# EAGLE design untitled (EAGLE 9.6.2)
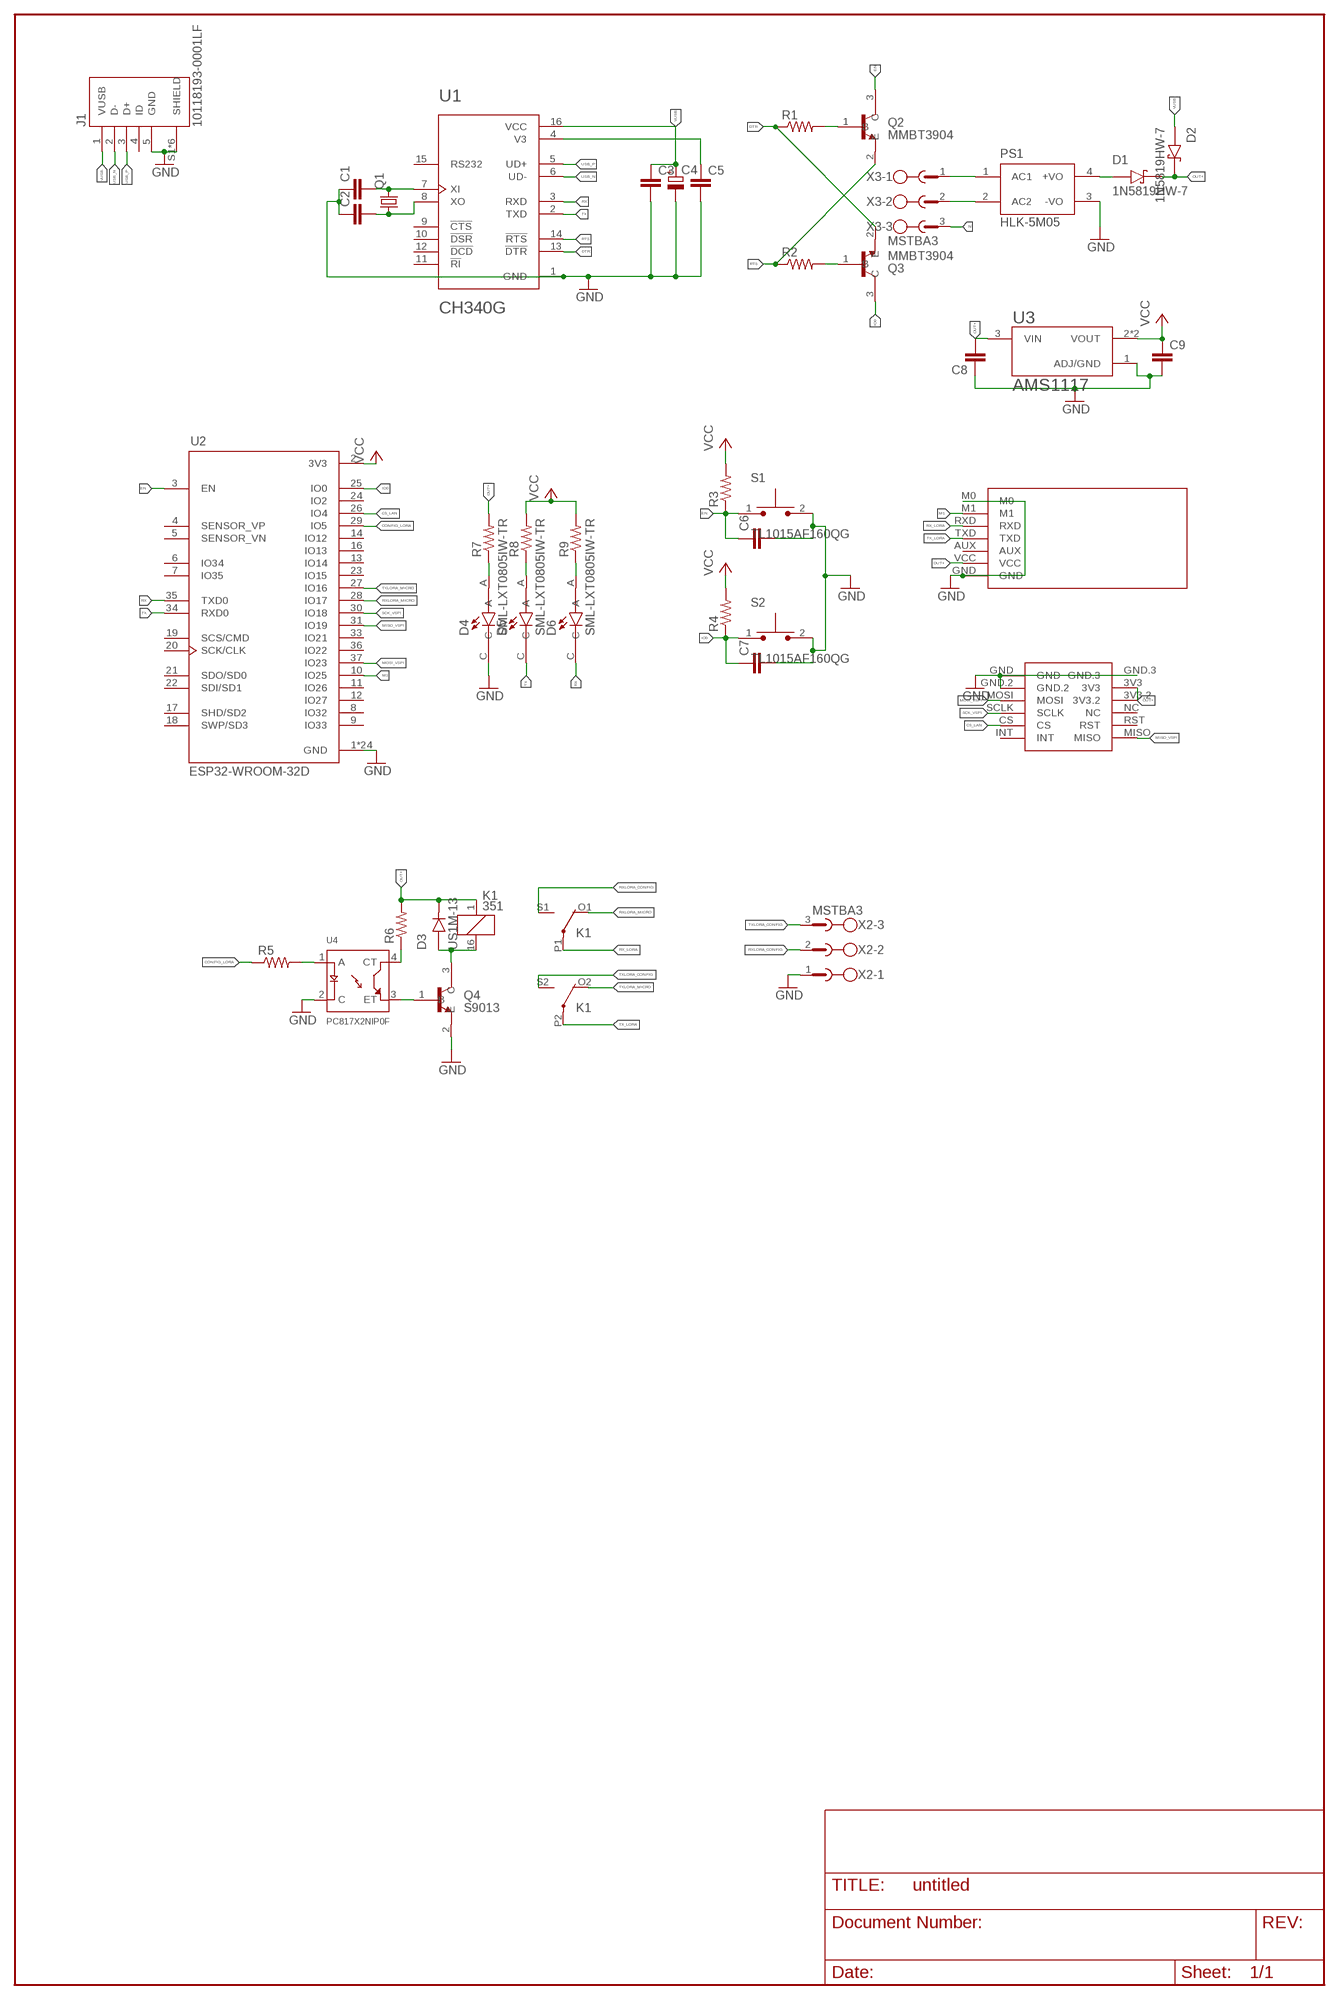
[diagram p0: schematic, sheet 1]

## Parts
C1  C-EUC0805K  [C0805K]
C2  C-EUC0805K  [C0805K]
C3  C-EUC0805K  [C0805K]
C4  CPOL-EU153CLV-0505  [153CLV-0505]
C5  C-EUC0805K  [C0805K]
C6  C-EUC0805K  [C0805K]
C7  C-EUC0805K  [C0805K]
C8  C-EUC0805K  [C0805K]
C9  C-EUC0805K  [C0805K]
D1  1N5819HW-7  [SOD3715X145N]
D2  1N5819HW-7  [SOD3715X145N]
D3  US1M-13  [DIOM5226X240N]
D4  SML-LXT0805IW-TR  [LEDC2012X120N]
D5  SML-LXT0805IW-TR  [LEDC2012X120N]
D6  SML-LXT0805IW-TR  [LEDC2012X120N]
EBYTEE220-900T22D1  EBYTEE220-900T22D  [EBYTEE220-900T22D]
J1  10118193-0001LF  [FCI_10118193-0001LF]
K1  351  [351]
PS1  HLK-5M05  [CONV_HLK-5M05]
Q1  CRYSTALSM49  [SM49]
Q2  MMBT3904  [SOT95P240X120-3N]
Q3  MMBT3904  [SOT95P240X120-3N]
Q4  S9013  [SOT95P240X120-3N]
R1  R-US_M0805  [M0805]
R2  R-US_M0805  [M0805]
R3  R-US_M0805  [M0805]
R4  R-US_M0805  [M0805]
R5  R-US_M0805  [M0805]
R6  R-US_M0805  [M0805]
R7  R-US_M0805  [M0805]
R8  R-US_M0805  [M0805]
R9  R-US_M0805  [M0805]
S1  TL1015AF160QG  [SW_TL1015AF160QG]
S2  TL1015AF160QG  [SW_TL1015AF160QG]
U1  CH340G  [SOIC127P600X180-16N]
U2  ESP32-WROOM-32D  [MODULE_ESP32-WROOM-32D]
U3  AMS1117  [SOT229P700X180-4N]
U4  PC817X2NIP0F  [SOT254P975X400-4N]
U$1  MINI_W5500  [MINI_W5500]
X2  MSTBA3  [MSTBA3]
X3  MSTBA3  [MSTBA3]

## Nets
CONFIG_LORA: R5.1 U2.29(IO5)
CS_LAN: U2.26(IO4) U$1.CS
DTR: Q3.2(E) R1.1 U1.13(!DTR)
EN: C6.1 Q2.3(C) R3.1 S1.1 U2.3(EN)
GND: C1.1 C2.1 C3.2 C4.- C5.2 C6.2 C7.2 C8.1 C9.2 D4.C EBYTEE220-900T22D1.GND EBYTEE220-900T22D1.M0 J1.5(GND) J1.S1(SHIELD) J1.S2(SHIELD) J1.S3(SHIELD) J1.S4(SHIELD) J1.S5(SHIELD) J1.S6(SHIELD) PS1.3(-VO) Q4.2(E) S1.2 S2.2 U1.1(GND) U2.1(GND) U2.15(GND) U2.38(GND) U2.39_1(GND) U2.39_2(GND) U2.39_3(GND) U2.39_4(GND) U2.39_5(GND) U2.39_6(GND) U2.39_7(GND) U2.39_8(GND) U2.39_9(GND) U2.39_10(GND) U2.39_11(GND) U2.39_12(GND) U2.39_13(GND) U2.39_14(GND) U2.39_15(GND) U2.39_16(GND) U2.39_17(GND) U2.39_18(GND) U2.39_19(GND) U2.39_20(GND) U2.39_21(GND) U3.1(ADJ/GND) U4.2(C) U$1.GND U$1.GND.2 U$1.GND.3 X2.1
IO0: C7.1 Q3.3(C) R4.1 S2.1 U2.25(IO0)
M1: EBYTEE220-900T22D1.M1 U2.10(IO25)
MISO_VSPI: U2.31(IO19) U$1.MISO
MOSI_VSPI: U2.37(IO23) U$1.MOSI
N: X3.3
N$1: D1.A PS1.4(+VO)
N$2: C5.1 U1.4(V3)
N$3: Q2.1(B) R1.2
N$4: Q3.1(B) R2.2
N$5: R5.2 U4.1(A)
N$6: D4.A R7.1
N$7: R6.1 U4.4(CT)
N$8: D3.A K1.16 Q4.3(C)
N$9: C1.2 Q1.2 U1.7(XI)
N$10: C2.2 Q1.1 U1.8(XO)
N$11: D5.A R8.1
N$12: Q4.1(B) U4.3(ET)
N$13: PS1.1(AC1) X3.1
N$14: PS1.2(AC2) X3.2
N$15: D6.A R9.1
OUT+: C8.2 D1.C(K) D2.C(K) D3.C(K) EBYTEE220-900T22D1.VCC K1.1 R6.2 R7.2 U3.3(VIN) U$1.3V3 U$1.3V3.2
RTS: Q2.2(E) R2.1 U1.14(!RTS)
RX: D6.C U1.3(RXD) U2.35(TXD0)
RX_LORA: EBYTEE220-900T22D1.RXD K1.P1(2:P)
RXLORA_CONFIG: K1.S1(2:S) X2.2
RXLORA_MICRO: K1.O1(2:O) U2.28(IO17)
SCK_VSPI: U2.30(IO18) U$1.SCLK
TX: D5.C U1.2(TXD) U2.34(RXD0)
TX_LORA: EBYTEE220-900T22D1.TXD K1.P2(3:P)
TXLORA_CONFIG: K1.S2(3:S) X2.3
TXLORA_MICRO: K1.O2(3:O) U2.27(IO16)
USB_N: J1.2(D-) U1.6(UD-)
USB_P: J1.3(D+) U1.5(UD+)
VCC: C9.1 R3.2 R4.2 R8.2 R9.2 U2.2(3V3) U3.2(VOUT) U3.4(VOUT)
VUSB: C3.1 C4.+ D2.A J1.1(VUSB) U1.16(VCC)
Unconnected: EBYTEE220-900T22D1.AUX J1.4(ID) U1.9(!CTS) U1.10(!DSR) U1.11(!RI) U1.12(!DCD) U1.15(RS232) U2.4(SENSOR_VP) U2.5(SENSOR_VN) U2.6(IO34) U2.7(IO35) U2.8(IO32) U2.9(IO33) U2.11(IO26) U2.12(IO27) U2.13(IO14) U2.14(IO12) U2.16(IO13) U2.17(SHD/SD2) U2.18(SWP/SD3) U2.19(SCS/CMD) U2.20(SCK/CLK) U2.21(SDO/SD0) U2.22(SDI/SD1) U2.23(IO15) U2.24(IO2) U2.33(IO21) U2.36(IO22) U$1.INT U$1.NC U$1.RST

## Library data of the parts
C1-C3 C5-C9 = rcl:C-EU: CAPACITOR, European symbol; SPICEPREFIX: C
C4 = rcl:CPOL-EU: POLARIZED CAPACITOR, European symbol; SPICEPREFIX: C
D1 D2 = 1N5819HW-7:1N5819HW-7: 1N5819HW Series 40 V 1 A Surface Mount Schottky Barrier Rectifier - SOD-123 Check availability <https://pricing.snapeda.com/parts/1N5819HW-7/Diodes%20Inc./view-part?ref=eda>; AVAILABILITY: In Stock; DESCRIPTION: Diode Schottky 40 V 1A Surface Mount SOD-123; MF: Diodes Inc.; MP: 1N5819HW-7; PACKAGE: SOD-123 Fairchild Semiconductor; PRICE: None; PURCHASE-URL: https://pricing.snapeda.com/search/part/1N5819HW-7/?ref=eda
D3 = US1M-13:US1M-13: Diode, Fast Recovery, 1a, 1kv, Do-214ac-2, Full Reel Check availability <https://pricing.snapeda.com/parts/US1M-13/Diodes%20Incorporated/view-part?ref=eda>; AVAILABILITY: In Stock; DESCRIPTION: Diode Standard 1000 V 1A Surface Mount SMA; MF: Diodes Incorporated; MP: US1M-13; PACKAGE: DO-214AC-214 Diodes Incorporated; PRICE: None; PURCHASE-URL: https://pricing.snapeda.com/search/part/US1M-13/?ref=eda
D4-D6 = SML-LXT0805IW-TR:SML-LXT0805IW-TR: LED; Luminous Intensity:11µcd; Viewing Angle:140°; Forward Current:30mA; Forward Voltage:2V; Color:Red; LED Color:Red; Leaded Process Compatible:Yes; Lens Color:White; Mounting Type:Surface Mount ;RoHS Compliant: Yes Check availability <https://pricing.snapeda.com/parts/SML-LXT0805IW-TR/Lumex%20Opto/Components/view-part?ref=eda>; AVAILABILITY: In Stock; DESCRIPTION: Red - LED Indication - Discrete 2V 0805 (2012 Metric); MF: Lumex Opto/Components; MP: SML-LXT0805IW-TR; PACKAGE: 0805 Lumex; PRICE: None; PURCHASE-URL: https://pricing.snapeda.com/search/part/SML-LXT0805IW-TR/?ref=eda
EBYTEE220-900T22D1 = EByte E220-900T22D:EBYTEE220-900T22D
J1 = 10118193-0001LF:10118193-0001LF: Micro USB B Type Receptacle Check availability <https://pricing.snapeda.com/parts/10118193-0001LF/FCI/view-part?ref=eda>; AVAILABILITY: In Stock; DESCRIPTION: USB - micro B USB 2.0 Receptacle Connector 5 Position Surface Mount, Right Angle; Through Hole; MF: FCI; MP: 10118193-0001LF; PACKAGE: None; PRICE: None; PURCHASE-URL: https://pricing.snapeda.com/search/part/10118193-0001LF/?ref=eda
K1 = relay:351: RELAY 2 x switch, Omron; OC_FARNELL: unknown; OC_NEWARK: unknown
PS1 = HLK-5M05:HLK-5M05: AC DC 220V to 5V 5W 5Watt Isolated Switching Step-Down Power Supply Module Converter Check availability <https://pricing.snapeda.com/parts/HLK-5M05/Hi-link/view-part?ref=eda>; AVAILABILITY: Not in stock; MF: Hi-link; MP: HLK-5M05; PACKAGE: Package; PRICE: None
Q1 = crystal:CRYSTAL: CRYSTAL; OC_FARNELL: unknown; OC_NEWARK: unknown
Q2 Q3 = MMBT3904:MMBT3904: MMBT3904 Series 40 V CE Breakdown 0.2 A NPN General Purpose Amplifier - SOT-23 Check availability <https://pricing.snapeda.com/parts/MMBT3904/ON%20Semiconductor/view-part?ref=eda>; AVAILABILITY: In Stock; DESCRIPTION: Bipolar (BJT) Transistor NPN 40 V 200 mA 300MHz 300 mW Surface Mount SOT-23-3 (TO-236); MF: ON Semiconductor; MP: MMBT3904; PACKAGE: SOT-23-3 Motorola; PRICE: None
Q4 = S9013:S9013: SMD Transistors NPN 25V-500mA Check availability <https://pricing.snapeda.com/parts/S9013/JCET/view-part?ref=eda>; AVAILABILITY: In Stock; DESCRIPTION: Bipolar (BJT) Transistor NPN 20V 500mA 625mW Through Hole TO-92-3; MF: JCET; MP: S9013; PACKAGE: SOT-23-3 JCET; PRICE: None; PURCHASE-URL: https://pricing.snapeda.com/search/part/S9013/?ref=eda
R1-R9 = rcl:R-US_: RESISTOR, American symbol; SPICEPREFIX: R
S1 S2 = TL1015AF160QG:TL1015AF160QG: Tactile Switch SPST-NO Top Actuated Surface Mount Check availability <https://pricing.snapeda.com/parts/TL1015AF160QG/E-Switch/view-part?ref=eda>; AVAILABILITY: In Stock; DESCRIPTION: Tactile Switch SPST-NO Top Actuated Surface Mount; MF: E-Switch; MP: TL1015AF160QG; PACKAGE: None; PRICE: None; PURCHASE-URL: https://pricing.snapeda.com/search/part/TL1015AF160QG/?ref=eda
U1 = CH340G:CH340G: Check availability <https://pricing.snapeda.com/parts/Ch340G/WCH/view-part?ref=eda>; AVAILABILITY: Not in stock; DESCRIPTION: USB Interface Integrated Circuit; MF: WCH; MP: Ch340G; PACKAGE: None; PRICE: None
U2 = ESP32-WROOM-32D:ESP32-WROOM-32D: Bluetooth, WiFi 802.11b/g/n, Bluetooth v4.2 + EDR, Class 1, 2 and 3 Transceiver Module 2.4GHz ~ 2.5GHz Integrated, Trace Surface Mount Check availability <https://pricing.snapeda.com/parts/ESP32-WROOM-32D/Espressif%20Systems/view-part?ref=eda>; AVAILABILITY: In Stock; DESCRIPTION: Bluetooth, WiFi 802.11b/g/n, Bluetooth v4.2 +EDR, Class 1, 2 and 3 Transceiver Module 2.4GHz ~ 2.5GHz Integrated; MF: Espressif Systems; MP: ESP32-WROOM-32D; PACKAGE: Module Espressif Systems; PRICE: None; PURCHASE-URL: https://pricing.snapeda.com/search/part/ESP32-WROOM-32D/?ref=eda
U3 = AMS1117:AMS1117: Sot223/Pkg 1-Amp 5-Volt Low Drop Out Voltage Regulatator Check availability <https://pricing.snapeda.com/parts/AMS1117/Advanced%20Monolithic%20Systems/view-part?ref=eda>; AVAILABILITY: Not in stock; DESCRIPTION: 1A LOW DROPOUT VOLTAGE REGULATOR SOT-223; MF: Advanced Monolithic Systems; MP: AMS1117; PACKAGE: SOT-223 Seeed Technology; PRICE: None
U4 = PC817X2NIP0F:PC817X2NIP0F: PC817 Series 1 Channel 80 V 5000 Vrms General Purpose Photocoupler - DIP-4 Check availability <https://pricing.snapeda.com/parts/PC817X2NIP0F/Sharp%20Microelectronics/view-part?ref=eda>; AVAILABILITY: Not in stock; DESCRIPTION: Optoisolator Transistor Output 5000Vrms 1 Channel 4-SMD; MF: Sharp Microelectronics; MP: PC817X2NIP0F; PACKAGE: SMD-4 Sharp Microelectronics; PRICE: None
U$1 = ethernet-mikroavr:MINI_W5500: MINI ETHERNET W5500, CREATE BY MIKROAVR.COM
X2 X3 = con-phoenix-508:MSTBA3: PHOENIX; MF: FARNELL; MPN: 1757255; OC_FARNELL: 3705183; OC_NEWARK: 71C4162

## Board
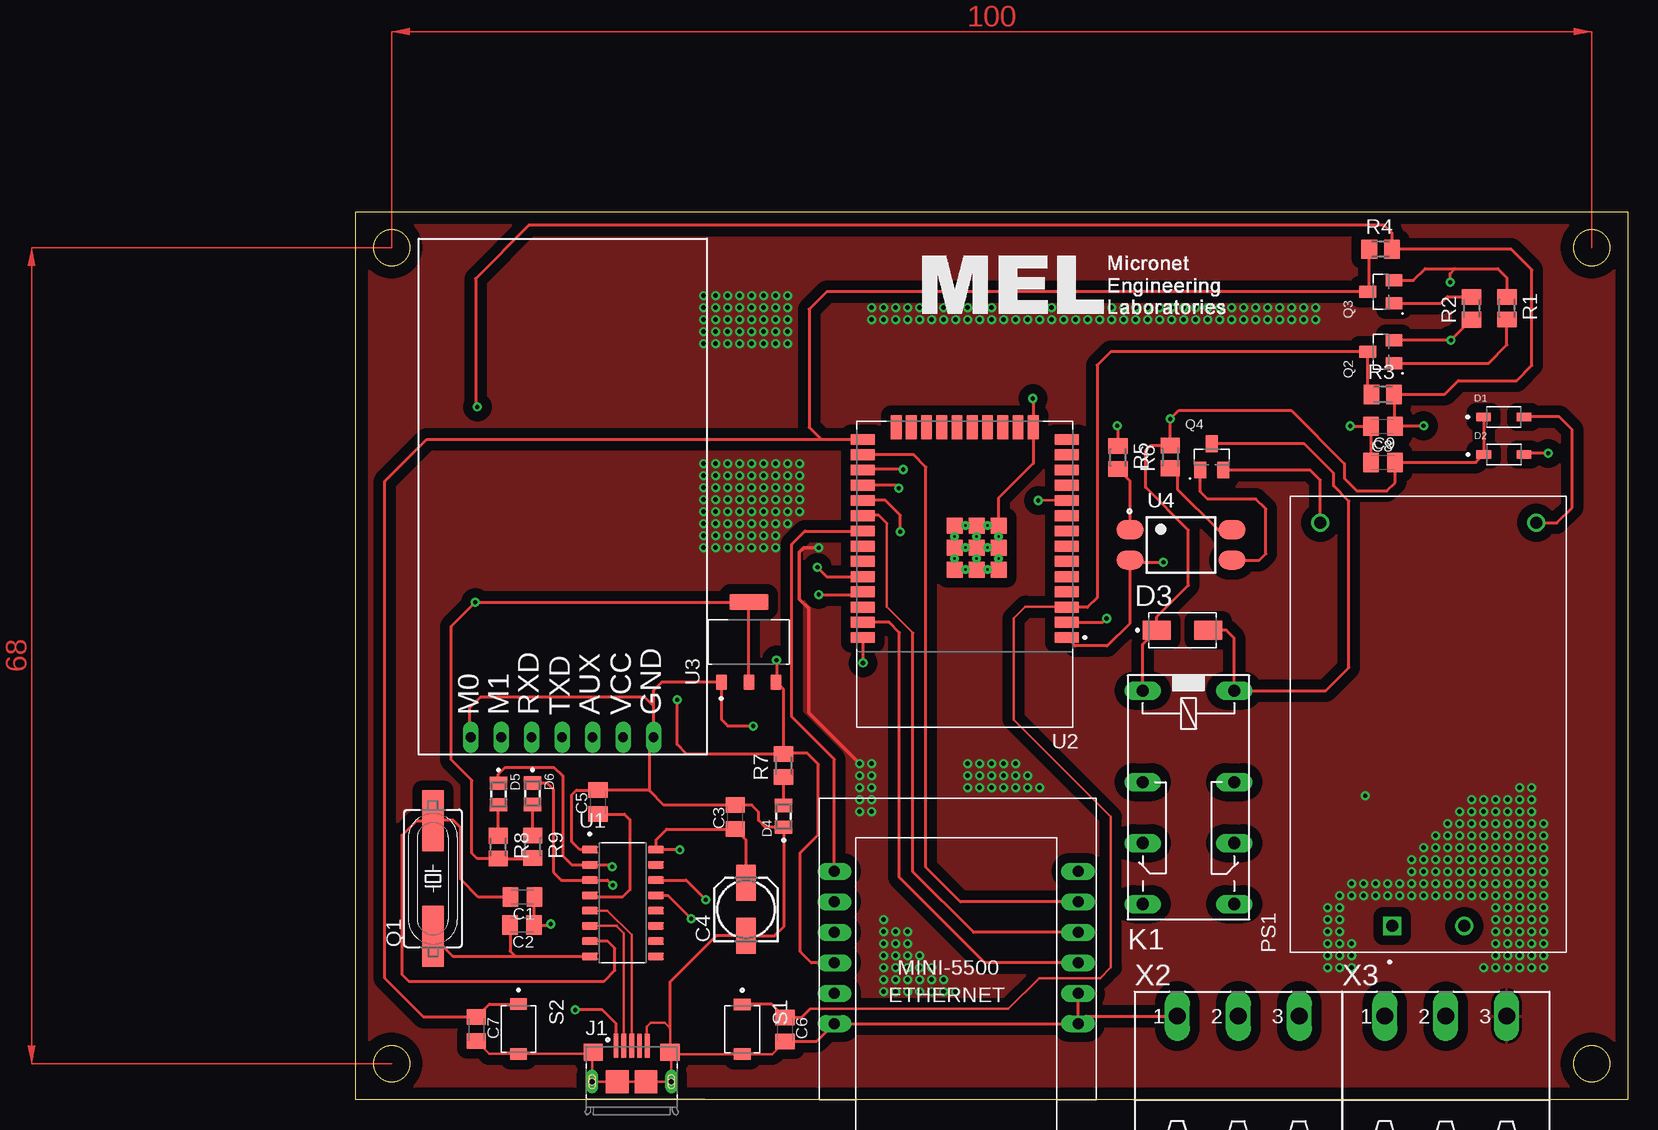
[diagram p1: board, top side]
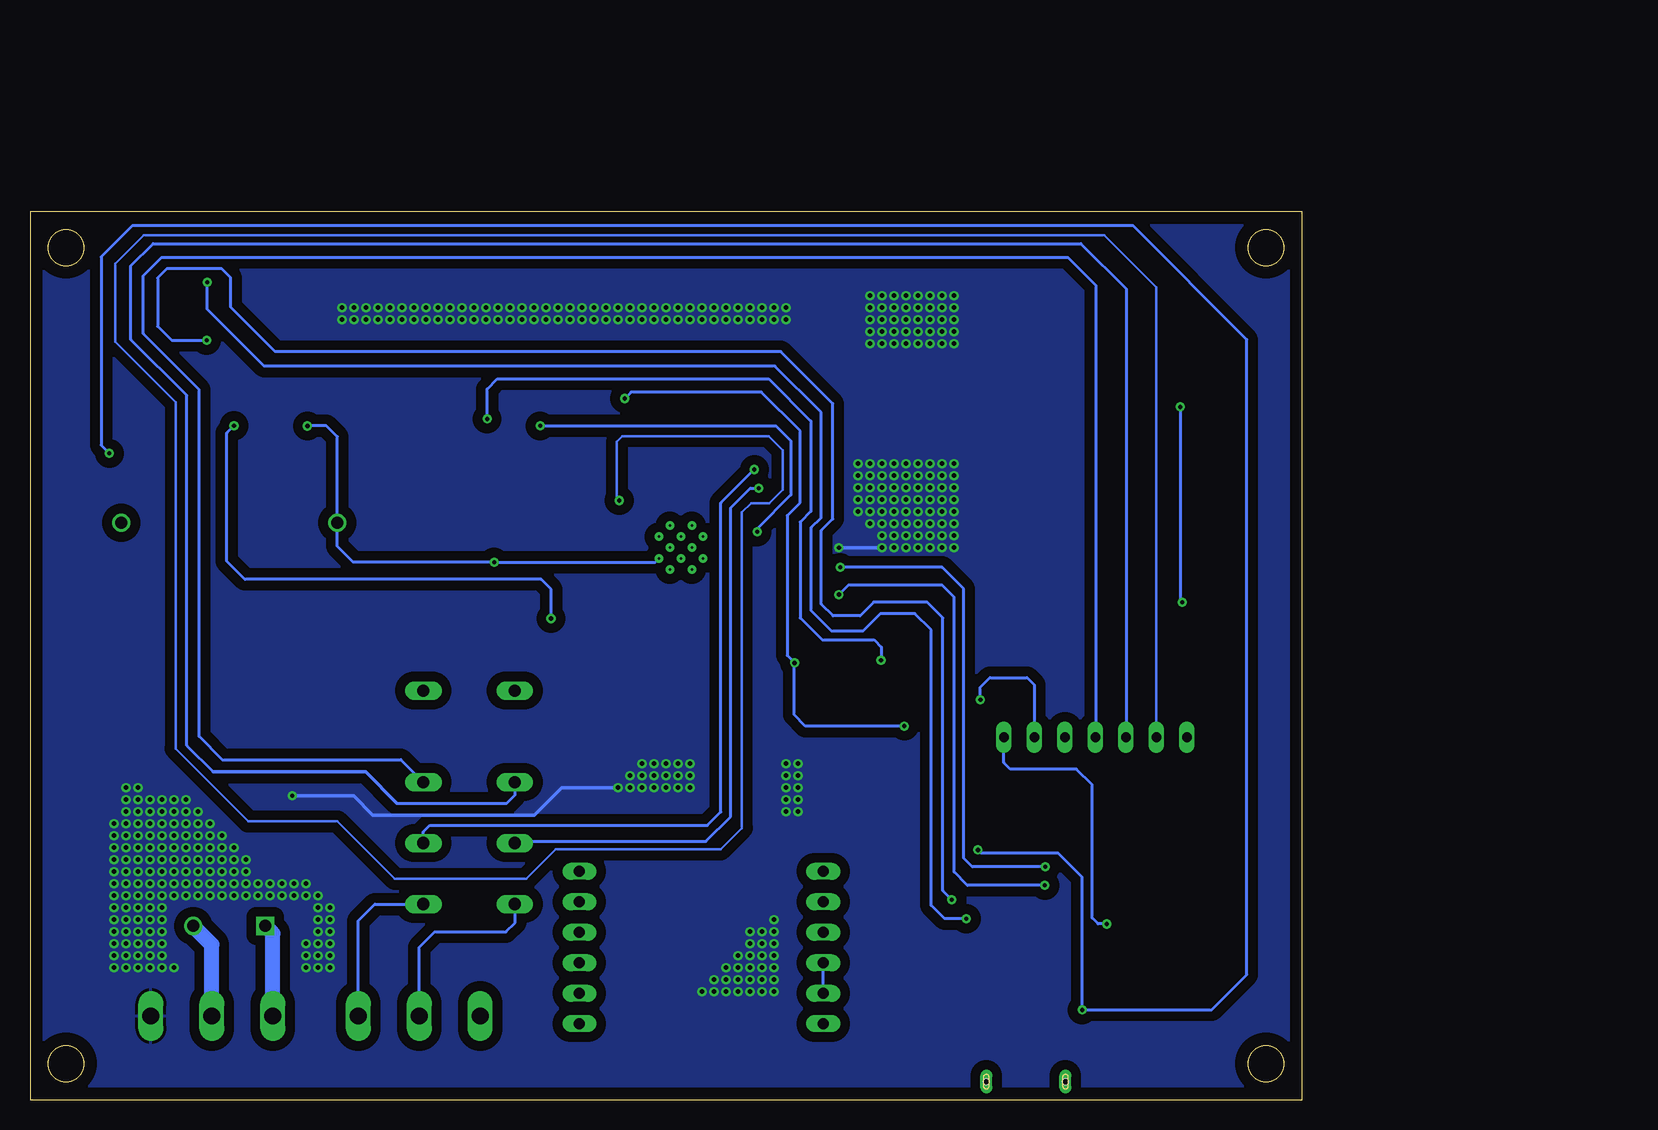
[diagram p2: board, bottom side, seen from below]

Size 106 x 74 mm. Coordinates in mm from the lower left corner, seen from the top.
Outline: 0,74 106,74 106,0 0,0 0,74
Outline: circle at 3,71 radius 1.5
Outline: circle at 103,71 radius 1.5
Outline: circle at 103,3 radius 1.5
Outline: circle at 3,3 radius 1.5
Copper layers (1*16): Top 0.035mm / dielectric 1.5mm / Bottom 0.035mm
Design rules "default": minimum track width 6mil, minimum drill 0.35mm, track to track 6mil, track to pad 6mil, pad to pad 6mil, via to via 6mil, smd to smd 6mil, copper to edge 40mil, drill to drill 6mil, minimum pad ring 10mil, minimum via ring 8mil, stop-mask expansion 4mil, vias tented up to drill 0mil, thermal gap 10mil

### Footprints (pad centres in the part's own frame; a part is rotated, then mirrored left to right if it is on the bottom)
C0805K = smd 1.3 x 1.6: 1 -1,0; 2 1,0
153CLV-0505 = smd 3 x 1.6: + 2.2,0; - -2.2,0
SOD3715X145N = smd 1.21 x 0.73: A 1.68,0; C -1.68,0
DIOM5226X240N = smd 2.33 x 1.55: A 2.135,0; C -2.135,0
LEDC2012X120N = smd 1.1 x 1.45: A 0.9,0; C -0.9,0
EBYTEE220-900T22D = drill 0.8 pad 1.27 long: AUX -4.56,-10.98; GND -4.56,-16.06; M0 -4.56,-0.82; M1 -4.56,-3.36; RXD -4.56,-5.9; TXD -4.56,-8.44; VCC -4.56,-13.52
FCI_10118193-0001LF = smd 0.4 x 2: 1 -1.3,2.975; 2 -0.65,2.975; 3 0,2.975; 4 0.65,2.975; 5 1.3,2.975 | smd 1.6 x 1.4: S1 -3.2,2.45; S2 3.2,2.45 | smd 1.9 x 1.9: S3 1.2,0; S4 -1.2,0 | drill 0.5 pad 0.9 long: S5 -3.3,0; S6 3.3,0 | hole 0.5: -3.3,0; 3.3,0
351 = drill 1.016 long: 1 -3.81,-3.81; 16 -3.81,3.81; O1 8.89,-3.81; O2 8.89,3.81; P1 3.81,-3.81; P2 3.81,3.81; S1 13.97,-3.81; S2 13.97,3.81
CONV_HLK-5M05 = drill 1 pad 1.5 square: 1 -16.8,3 | drill 1 pad 1.5: 2 -16.8,-3; 3 16.8,9; 4 16.8,-9
SM49 = smd 5.08 x 1.778: 1 -4.826,0; 2 4.826,0
SOT95P240X120-3N = smd 1 x 1.4: 1 -0.95,-1.1; 2 0.95,-1.1; 3 0,1.1
M0805 = smd 1.3 x 1.6: 1 -0.95,0; 2 0.95,0
SW_TL1015AF160QG = smd 0.95 x 1.4: 1 -2.075,0; 2 2.075,0
SOIC127P600X180-16N = smd 1.31 x 0.62: 1 -2.75,4.445; 2 -2.75,3.175; 3 -2.75,1.905; 4 -2.75,0.635; 5 -2.75,-0.635; 6 -2.75,-1.905; 7 -2.75,-3.175; 8 -2.75,-4.445; 9 2.75,-4.445; 10 2.75,-3.175; 11 2.75,-1.905; 12 2.75,-0.635; 13 2.75,0.635; 14 2.75,1.905; 15 2.75,3.175; 16 2.75,4.445
MODULE_ESP32-WROOM-32D = smd 2 x 0.9: 1 -8.5,5.26; 2 -8.5,3.99; 3 -8.5,2.72; 4 -8.5,1.45; 5 -8.5,0.18; 6 -8.5,-1.09; 7 -8.5,-2.36; 8 -8.5,-3.63; 9 -8.5,-4.9; 10 -8.5,-6.17; 11 -8.5,-7.44; 12 -8.5,-8.71; 13 -8.5,-9.98; 14 -8.5,-11.25; 25 8.5,-11.25; 26 8.5,-9.98; 27 8.5,-8.71; 28 8.5,-7.44; 29 8.5,-6.17; 30 8.5,-4.9; 31 8.5,-3.63; 32 8.5,-2.36; 33 8.5,-1.09; 34 8.5,0.18; 35 8.5,1.45; 36 8.5,2.72; 37 8.5,3.99; 38 8.5,5.26 | smd 0.9 x 2: 15 -5.715,-12.25; 16 -4.445,-12.25; 17 -3.175,-12.25; 18 -1.905,-12.25; 19 -0.635,-12.25; 20 0.635,-12.25; 21 1.905,-12.25; 22 3.175,-12.25; 23 4.445,-12.25; 24 5.715,-12.25 | smd 1.33 x 1.33: 39_1 -2.835,-0.405; 39_2 -1,-0.405; 39_3 0.835,-0.405; 39_4 -2.835,-2.24; 39_5 -1,-2.24; 39_6 0.835,-2.24; 39_7 -2.835,-4.075; 39_8 -1,-4.075; 39_9 0.835,-4.075 | drill 0.2 pad 0.3: 39_10 -1.917,-0.405; 39_11 -0.083,-0.405; 39_12 -2.835,-1.323; 39_13 -1,-1.323; 39_14 0.835,-1.323; 39_15 -1.917,-2.24; 39_16 -0.083,-2.24; 39_17 -2.835,-3.158; 39_18 -1,-3.158; 39_19 0.835,-3.158; 39_20 -1.917,-4.075; 39_21 -0.083,-4.075
SOT229P700X180-4N = smd 1.31 x 0.93: 1 -3.345,2.29; 2 -3.345,0; 3 -3.345,-2.29 | smd 1.31 x 3.24: 4 3.345,0
SOT254P975X400-4N = smd 2.25 x 1.6: 1 -4.25,1.27; 2 -4.25,-1.27; 3 4.25,-1.27; 4 4.25,1.27
MINI_W5500 = drill 0.914 long: 3V3 21.844,-8.89; 3V3.2 21.844,-11.43; CS 1.524,-16.51; GND 1.524,-6.35; GND.2 1.524,-8.89; GND.3 21.844,-6.35; INT 1.524,-19.05; MISO 21.844,-19.05; MOSI 1.524,-11.43; NC 21.844,-13.97; RST 21.844,-16.51; SCLK 1.524,-13.97
MSTBA3 = drill 1.397 long: 1 -5.08,5.08; 2 0,5.08; 3 5.08,5.08

### Placement (x,y rotation side)
C1  13.91,16.87 180 top
C2  13.87,14.55 180 top
C3  31.63,23.53 90 top
C4  32.54,15.85 90 top
C5  20.2,24.79 90 top
C6  35.78,5.85 270 top
C7  10.07,5.87 270 top
C8  85.63,53.1 0 top
C9  85.61,56.1 180 top
D1  95.69,56.88 0 top
D2  95.7,53.76 0 top
D3  68.91,39.11 0 top
D4  35.68,23.6 90 top
D5  11.91,25.46 270 top
D6  14.74,25.49 270 top
EBYTEE220-900T22D1  8.78,34.75 90 top
J1  23.01,1.49 0 top
K1  69.41,30.26 270 top
PS1  89.39,31.26 90 top
Q1  6.46,18.42 90 top
Q2  85.44,62.33 90 top
Q3  85.44,67.32 90 top
Q4  71.34,53.56 0 top
R1  95.95,65.94 270 top
R2  92.99,65.94 90 top
R3  85.6,58.76 0 top
R4  85.42,70.85 0 top
R5  63.54,53.5 270 top
R6  67.9,53.56 90 top
R7  35.66,27.83 90 top
R8  11.9,21.04 270 top
R9  14.76,21.07 270 top
S1  32.22,5.86 270 top
S2  13.59,5.89 270 top
U1  22.28,16.38 0 top
U2  50.76,43.76 180 top
U3  32.77,38.13 90 top
U4  68.79,46.21 0 top
U$1  61.74,-0.03 180 top
X2  73.56,1.88 0 top
X3  90.85,1.87 0 top

### Tracks (layer width: path | path; a pad name or v marks a point on that pad's centre or on a via)
CONFIG_LORA  (via drill 0.35)
  Top 0.254: R5.1 63.54,56.09 v63.48,56.14 | v45.4,47.3 45.4,48.68 44.16,49.93 U2.29
  Bottom 0.254: v63.48,56.14 43.85,56.14 42.59,54.88 42.59,50.39 45.4,47.58 v45.4,47.3
CS_LAN
  Top 0.254: U$1.CS 50.39,16.48 47.53,19.34 47.53,52.71 46.5,53.74 42.99,53.74 42.84,53.59 42.4,53.59 U2.26
DTR  (via drill 0.35)
  Top 0.254: Q3.2 88.15,68.27 89.12,69.24 91.62,69.24 | 91.62,69.24 95.19,69.24 95.94,68.47 R1.1 | U1.13 26.03,17.02 v27.98,15.07 | v91.22,68.11 91.22,68.84 91.62,69.24
  Bottom 0.254: v27.98,15.07 29.79,15.07 30.9,16.18 30.9,39.13 32.27,40.5 35.14,40.5 36.59,39.05 39.2,39.05 40.88,40.72 40.88,47.68 40.07,48.48 40.07,57.27 43.92,61.12 86.49,61.12 91.24,65.88 91.24,68.09 v91.22,68.11
EN
  Top 0.203: 37.88,7.56 54.4,7.56 56.97,10.13 62.05,10.13 62.94,11.02 62.94,23.56 54.84,31.66 54.84,40.09 55.82,41.08 59.22,41.08 U2.3
  Top 0.254: S1.1 34.69,7.94 C6.1 37.17,6.85 37.88,7.56 | R3.1 84.34,59.06 Q2.3 62.93,62.33 61.81,61.2 61.81,41.84 60.98,41.02 59.28,41.02 U2.3
GND  (via drill 0.35)
  Top 0.203: 26.31,3.84 J1.S6 J1.S3 J1.S4 J1.S5 19.71,3.84 J1.S1 19.68,3.81 S2.2 11.13,3.81 C7.2 | 26.31,3.84 J1.S2 26.21,5.93 25.75,6.39 24.62,6.39 24.28,6.05 24.28,4.5 J1.5 | 26.31,3.84 26.36,3.79 S1.2 34.72,3.79 C6.2
  Top 0.254: C6.2 38.42,4.85 U$1.GND.3 U$1.GND | U$1.GND U$1.GND.2 | U$1.GND 60.86,6.96 X2.1 | C2.1 | PS1.3 80.39,51.62 79.55,52.46 Q4.2 | C8.1 84.63,56.08 C9.2 84.58,56.13 v82.88,56.13 | U1.1 18.69,20.82 18.03,21.49 18.03,25.41 18.41,25.79 C5.2 24.44,25.79 24.5,25.72 | D4.C 35.34,22.7 | 35.34,22.7 34.14,22.7 33.59,23.26 33.59,23.96 33.02,24.53 C3.2 25.69,24.53 24.5,25.72 | 24.84,32.57 EBYTEE220-900T22D1.GND 24.5,29.86 24.5,25.72 | 24.84,32.57 24.84,32.78 24.11,33.51 10.41,33.51 9.49,32.59 9.49,30.3 EBYTEE220-900T22D1.M0 | 24.84,32.57 24.83,32.58 24.83,34.07 25.54,34.78 U3.1 30.48,31.67 31.01,31.14 33.14,31.14 v33.14,31.12 | 35.34,22.7 35.71,22.34 35.71,14.46 34.9,13.65 C4.- 32.5,13.69 30.09,13.69 26.21,9.8 26.21,5.93 | U2.1 59.96,37.8 62.63,37.8 64.54,39.71 U4.2 64.69,44.79 v67.32,44.79 | U2.39_7 53.63,47.83 53.63,46.95 U2.39_17 U2.39_4 | U2.39_7 53.6,50.14 56.48,53.02 U2.15 56.48,58.39 v56.44,58.42 | 50.02,47.83 U2.39_21 U2.39_8 51.83,47.83 | 50.02,47.83 U2.39_9 | 51.83,47.83 U2.39_20 U2.39_7 | 51.83,47.83 51.76,47.76 U2.39_18 51.76,46.04 | 51.76,46.04 U2.39_5 51.81,46 | 50.02,47.83 49.93,47.73 U2.39_19 49.93,46.04 | 49.93,46.04 U2.39_6 | 50.01,46 U2.39_16 50.88,46.04 51.76,46.04 | 50.01,46 49.97,46 49.93,46.04 | 51.81,46 U2.39_15 U2.39_4 | U2.39_4 U2.39_12 U2.39_1 U2.39_10 U2.39_2 | 51.81,46 51.76,45.95 U2.39_13 U2.39_2 | 50.01,46 49.93,45.91 U2.39_14 50.05,44.95 50.05,44.16 | U2.39_3 50.05,44.16 | 50.05,44.16 U2.39_11 U2.39_2 | U2.38 42.26,36.41 v42.29,36.39 | C2.1 14.88,16.84 C1.1 | C2.1 16.27,14.55 16.31,14.59 v16.27,14.63
  Bottom 0.254: U2.39_12 53.89,44.79 v67.32,44.79 79.08,44.79 80.39,46.1 PS1.3 80.39,55.24 81.31,56.15 82.86,56.15 v82.88,56.13 | v56.44,58.42 55.91,58.95 45.05,58.95 41.83,55.73 41.83,49.75 42.91,48.67 42.91,37.01 v42.29,36.39 42.33,36.34 42.33,32.07 41.38,31.12 v33.14,31.12 | v16.27,14.63 16.98,14.63 17.5,15.14 17.5,26.24 18.8,27.54 24.29,27.54 24.84,28.09 EBYTEE220-900T22D1.GND
IO0
  Top 0.254: S2.1 11.16,7.96 C7.1 5.68,6.87 2.44,10.11 2.44,51.51 5.94,55.01 38.82,55.01 | R4.1 84.47,67.45 Q3.3 39.25,67.32 37.81,65.87 37.81,56.02 38.82,55.01 | 38.82,55.01 42.13,55.01 U2.25
M1  (via drill 0.35)
  Top 0.203: v56.9,49.92 56.92,49.95 59.24,49.95 U2.10
  Bottom 0.203: EBYTEE220-900T22D1.M1 12.14,67.7 16.48,72.04 96.54,72.04 98.91,69.66 98.91,63.16 93.87,58.11 93.87,29.24 87.82,23.19 80.38,23.19 75.59,18.4 64.64,18.4 62.19,20.86 48.44,20.86 46.67,22.63 46.67,48.94 45.91,49.7 44.38,49.7 43.26,50.83 43.26,54.1 44.42,55.26 56.64,55.26 57.1,54.8 57.1,50.13 v56.9,49.92
MISO_VSPI
  Top 0.254: U$1.MISO 39.9,28.34 36.35,31.88 36.35,46.27 37.45,47.36 42.24,47.36 U2.31
MOSI_VSPI
  Top 0.254: U$1.MOSI 52.43,11.4 45.31,18.52 45.31,38.92 44.47,39.77 U2.37
N  (via drill 0.35)
  Top 0.305: v42,28 37.75,32.25 37.75,40.93 36.99,41.69 36.99,45.62 37.34,45.98 v38.59,45.98
  Bottom 0.305: v38.59,45.98 35.02,45.98 v35,46 | v57,26 61.69,26 63.99,23.7 77.43,23.7 79.03,25.3 84.14,25.3 v84.15,25.31
  other vias: 33,63 36,63 35,63 30,64 34,63 32,63 56,26 55,26 54,26 53,26 52,26 51,26 51,27 52,27 53,27 54,27 55,27 56,27 55,28 54,28 53,28 52,28 51,28 31,63 30,63 29,63 29,64 31,64 32,64 33,64 34,64 35,64 36,64 36,65 35,65 34,65 33,65 32,65 31,65 30,65 29,65 29,66 30,66 31,66 32,66 33,66 34,66 35,66 36,66 36,67 35,67 34,67 33,67 32,67 31,67 30,67 29,67 34,46 33,46 32,46 31,46 30,46 29,46 29,47 30,47 31,47 32,47 33,47 34,47 35,47 36,48 35,48 34,48 33,48 32,48 31,48 30,48 29,48 29,49 30,49 31,49 32,49 33,49 34,49 35,49 36,49 37,49 37,50 36,50 35,50 34,50 33,50 32,50 31,50 30,50 29,50 29,51 30,51 31,51 32,51 33,51 34,51 35,51 36,51 37,51 37,52 36,52 35,52 34,52 33,52 32,52 31,52 30,52 29,52 29,53 30,53 31,53 32,53 33,53 34,53 35,53 36,53 37,53 94,11 95,11 96,11 97,11 98,11 99,11 81,11 82,11 83,11 43,66 44,66 45,66 43,65 44,65 45,65 46,65 46,66 47,66 47,65 48,65 48,66 49,65 49,66 50,65 50,66 51,65 51,66 52,65 52,66 53,65 53,66 54,65 54,66 55,65 55,66 56,65 56,66 57,65 57,66 58,65 58,66 59,65 59,66 60,65 60,66 61,65 61,66 62,65 62,66 63,65 63,66 64,65 64,66 65,65 65,66 66,65 66,66 67,66 67,65 68,66 68,65 69,66 69,65 70,66 70,65 71,66 71,65 72,66 72,65 73,66 73,65 74,66 74,65 75,66 75,65 76,66 76,65 77,66 77,65 78,66 78,65 79,66 79,65 80,66 80,65 95,12 95,13 96,13 96,12 97,12 97,13 98,13 98,12 99,12 99,13 81,12 82,12 82,13 82,14 81,13 81,14 83,12 83,13 82,15 82,16 81,16 81,15 82,17 83,17 83,18 84,18 85,18 86,18 87,18 88,18 89,18 84,17 85,17 86,17 87,17 88,17 89,17 90,17 91,17 92,17 93,17 90,18 91,18 92,18 93,18 95,14 95,15 95,16 95,17 94,17 94,18 95,18 96,14 96,15 96,16 96,17 96,18 97,14 97,15 97,16 97,17 97,18 98,18 98,17 98,16 98,15 98,14 99,14 99,15 99,16 99,17 99,18 88,19 88,20 89,21 90,22 91,23 92,24 90,20 91,20 92,20 93,20 94,20 97,20 95,20 96,20 98,20 99,20 99,21 99,22 99,23 91,21 92,21 93,21 90,21 89,20 94,21 95,21 96,21 97,21 98,21 98,22 98,23 98,24 98,25 98,26 97,25 97,24 97,23 97,22 95,22 96,22 96,23 96,24 96,25 94,25 95,25 93,25 92,23 92,22 91,22 93,23 94,23 95,23 95,24 94,24 93,24 93,22 97,26 94,22 50,9 49,9 48,9 47,9 46,9 45,9 44,9 44,10 45,10 46,10 47,10 48,10 49,10 48,11 47,11 46,11 45,11 44,11 44,12 44,13 44,14 44,15 45,14 45,13 45,12 46,12 46,13 47,12 46,14 43,24 42,24 42,25 43,25 43,26 42,26 42,27 43,28 43,27 89,19 90,19 91,19 92,19 93,19 94,19 95,19 96,19 97,19 98,19 99,19
  pour Bottom (isolate 0.813): 0,74 106,74 106,0 0,0
  pour Top (isolate 0.813): 0,74 106,74 106,0 0,0
N$1
  Top 0.254: PS1.4 100.12,48.06 101.38,49.33 101.38,55.83 100.33,56.88 D1.A
N$2
  Top 0.254: C5.1 22.39,23.79 22.85,23.33 22.85,17.48 22.23,16.86 19.68,16.86 U1.4
N$3
  Top 0.254: Q2.1 94.43,61.38 95.94,62.89 R1.2
N$4
  Top 0.254: Q3.1 90.44,66.37 90.99,66.91 92.97,66.91 R2.2
N$5
  Top 0.254: U4.1 64.54,51.55 R5.2
N$6
  Top 0.254: D4.A 35.66,24.52 R7.1
N$7
  Top 0.254: U4.4 71.88,47.48 68.5,50.87 68.5,52.02 R6.1
N$8
  Top 0.254: D3.A 72.56,39.11 73.22,38.45 K1.16 80.85,34.07 82.77,35.99 82.77,49.87 81.51,51.13 81.51,52.19 79.04,54.66 Q4.3
N$9
  Top 0.254: U1.7 21.01,13.21 21.61,12.6 21.61,10.77 20.68,9.83 4.47,9.83 3.88,10.42 3.88,22.04 5.09,23.25 Q1.2 8.16,23.26 8.75,22.66 8.75,18.37 10.24,16.87 C1.2
N$10
  Top 0.254: 13.33,11.91 19.5,11.91 U1.8 | 13.33,11.91 8.14,11.91 Q1.1 | C2.2 12.88,12.37 13.33,11.91
N$11
  Top 0.254: R8.1 11.9,24.55 D5.A
N$12
  Top 0.254: U4.3 75.32,44.94 75.85,45.47 75.85,49.22 75.03,50.04 71.01,50.04 70.39,50.66 Q4.1
N$13
  Bottom 1.27: X3.1 85.77,13.84 PS1.1
N$14
  Bottom 1.27: X3.2 90.85,12.9 92.39,14.45 PS1.2
N$15
  Top 0.254: R9.1 14.76,24.57 D6.A
OUT+  (via drill 0.35)
  Top 0.254: K1.1 65.6,37.94 D3.C 66.77,40.23 69.4,42.86 69.4,47.45 65.84,51.02 65.84,54.08 66.27,54.51 R6.2 v67.9,56.72 68.61,57.43 77.97,57.43 82.4,53 82.4,51.76 83.44,50.72 85.95,50.72 86.63,51.4 C8.2 93.35,53.1 D2.C D1.C | U$1.3V3.2 37.99,11.4 37.07,12.32 37.07,20.55 38.56,22.05 38.56,27.93 37.64,28.84 35.72,28.84 R7.2 | R7.2 35.66,34.18 U3.3 35.08,34.81 v35.08,36.62 | R7.2 27.61,28.78 26.8,29.6 v26.8,33.33
  Bottom 0.254: U$1.3V3 U$1.3V3.2 | v26.8,33.33 26.8,34.37 26,35.16 22.91,35.16 22.3,34.55 EBYTEE220-900T22D1.VCC | v67.9,56.72 67.9,59.2 67.05,60.05 44.44,60.05 40.92,56.53 40.92,49.01 41.81,48.11 41.81,40.15 39.97,38.3 35.65,38.3 35.05,37.7 35.05,36.64 v35.08,36.62
RTS  (via drill 0.35)
  Top 0.254: R2.1 v91.28,63.28 Q2.2 | U1.14 27.54,18.29 v29.18,16.65
  Bottom 0.254: v29.18,16.65 29.93,17.41 29.93,40.14 31.24,41.45 35.69,41.45 36.83,40.31 39.07,40.31 40.06,41.29 40.06,47.43 39.09,48.39 39.09,57.99 43.43,62.33 85.58,62.33 89.28,66.03 89.28,68.49 90.03,69.25 94.6,69.25 95.36,68.48 95.36,64.44 94.18,63.26 91.29,63.26 91.22,63.33 91.23,63.33 v91.28,63.28
RX  (via drill 0.35)
  Top 0.254: D6.C 15.95,26.39 16.49,25.84 16.49,18.95 17.15,18.29 U1.3 20.98,18.29 v21.42,17.84 v21.43,17.85 | v38.59,42.08 42.03,42.08 U2.35
  Bottom 0.254: v21.43,17.85 27.88,17.85 29,18.98 29,41.87 30.01,42.88 37.79,42.88 v38.59,42.08
RX_LORA
  Bottom 0.254: K1.P1 65.6,25.38 66.26,24.71 75.42,24.71 | EBYTEE220-900T22D1.RXD 14.64,30.22 14.64,67.55 18.42,71.33 95.75,71.33 97.58,69.49 97.58,63.33 92.93,58.68 92.93,29.5 90.74,27.31
  Bottom 0.305: 90.74,27.31 78.02,27.31 75.42,24.71
RXLORA_CONFIG
  Bottom 0.254: X2.2 73.56,12.7 72.28,13.98 66.35,13.98 65.57,14.75 65.57,16.27 K1.S1
RXLORA_MICRO  (via drill 0.35)
  Top 0.254: v45.28,50.95 45.2,50.95 44.95,51.2 U2.28
  Bottom 0.254: K1.O1 65.46,21.51 49.68,21.51 47.62,23.57 47.62,49.3 45.98,50.95 v45.28,50.95
SCK_VSPI
  Top 0.203: 46.45,38.89 44.27,41.06 44.27,48.01
  Top 0.254: U$1.SCLK 51.5,13.94 46.45,18.99 46.45,38.89 | 44.27,48.01 43.58,48.7 42.3,48.7 U2.30
TX  (via drill 0.35)
  Top 0.254: D5.C 11.91,27.12 12.47,27.69 16.52,27.69 17.25,26.96 17.25,20.34 18.03,19.55 U1.2 21.23,19.55 v21.4,19.39 | v38.49,44.35 39.26,43.58 U2.34
  Bottom 0.254: v21.4,19.39 27.47,19.39 28.19,20.12 28.19,42.55 30,44.35 v38.49,44.35
TX_LORA
  Bottom 0.254: K1.P2 75.1,28.33 89.98,28.33 91.91,30.26 91.91,59.17 96.56,63.82 96.56,68.67 95.04,70.18 19.5,70.18 17.19,67.87 17.19,30.22 EBYTEE220-900T22D1.TXD
TXLORA_CONFIG
  Bottom 0.254: X2.3 78.64,14.91 77.26,16.29 K1.S2
TXLORA_MICRO  (via drill 0.35)
  Top 0.254: v45.64,52.51 42.3,52.51 U2.27
  Bottom 0.254: K1.O2 73.22,22.31 72.68,22.84 49.56,22.84 48.44,23.97 48.44,49.73 45.66,52.51 v45.64,52.51
USB_N
  Top 0.203: 21.75,14.48 21.74,14.48 | J1.2 22.36,13.86 21.77,14.45 21.75,14.48 | U1.6 21.75,14.48
USB_P
  Top 0.203: J1.3 23.01,13.71 20.98,15.75 U1.5
VCC  (via drill 0.35)
  Top 0.254: R8.2 | U3.2 32.77,41.38 | 32.77,41.38 U3.4 | R8.2 14.73,20.09 R9.2 | R8.2 10.14,20.09 9.7,20.53 9.7,26.6 7.98,28.32 7.98,39.43 v9.98,41.43 32.72,41.43 32.77,41.38 | U2.2 62.26,39.77 v62.58,40.09 | v89,56.15 88.95,56.1 C9.1 86.61,58.7 R3.2 90.76,58.76 91.91,59.91 96.76,59.91 98.03,61.18 98.03,69.13 96.3,70.86 R4.2 86.37,72.21 85.73,72.85 14.44,72.85 10.01,68.42 10.01,57.85 v10.15,57.72
  Bottom 0.254: v62.58,40.09 62.58,42.52 63.41,43.34 88.1,43.34 89.59,44.84 89.59,55.56 v89,56.15 | v10.15,57.72 10.15,41.61 9.92,41.38 9.93,41.38 v9.98,41.43
VUSB  (via drill 0.35)
  Top 0.254: C4.+ 32.54,21.62 C3.1 25.93,22.53 25.03,21.63 U1.16 25.05,20.8 v27.01,20.8 | J1.1 21.71,6.33 20.57,7.47 v18.32,7.47 | v99.39,53.85 97.47,53.85 D2.A
  Bottom 0.254: v27.01,20.8 26.77,20.56 20.35,20.56 18.32,18.53 v18.32,7.47 7.54,7.47 4.59,10.41 4.59,63.32 14.11,72.84 97.46,72.84 100.08,70.21 100.08,54.55 v99.39,53.85
(copper drawn outside any net)
  shapes: Top area x2